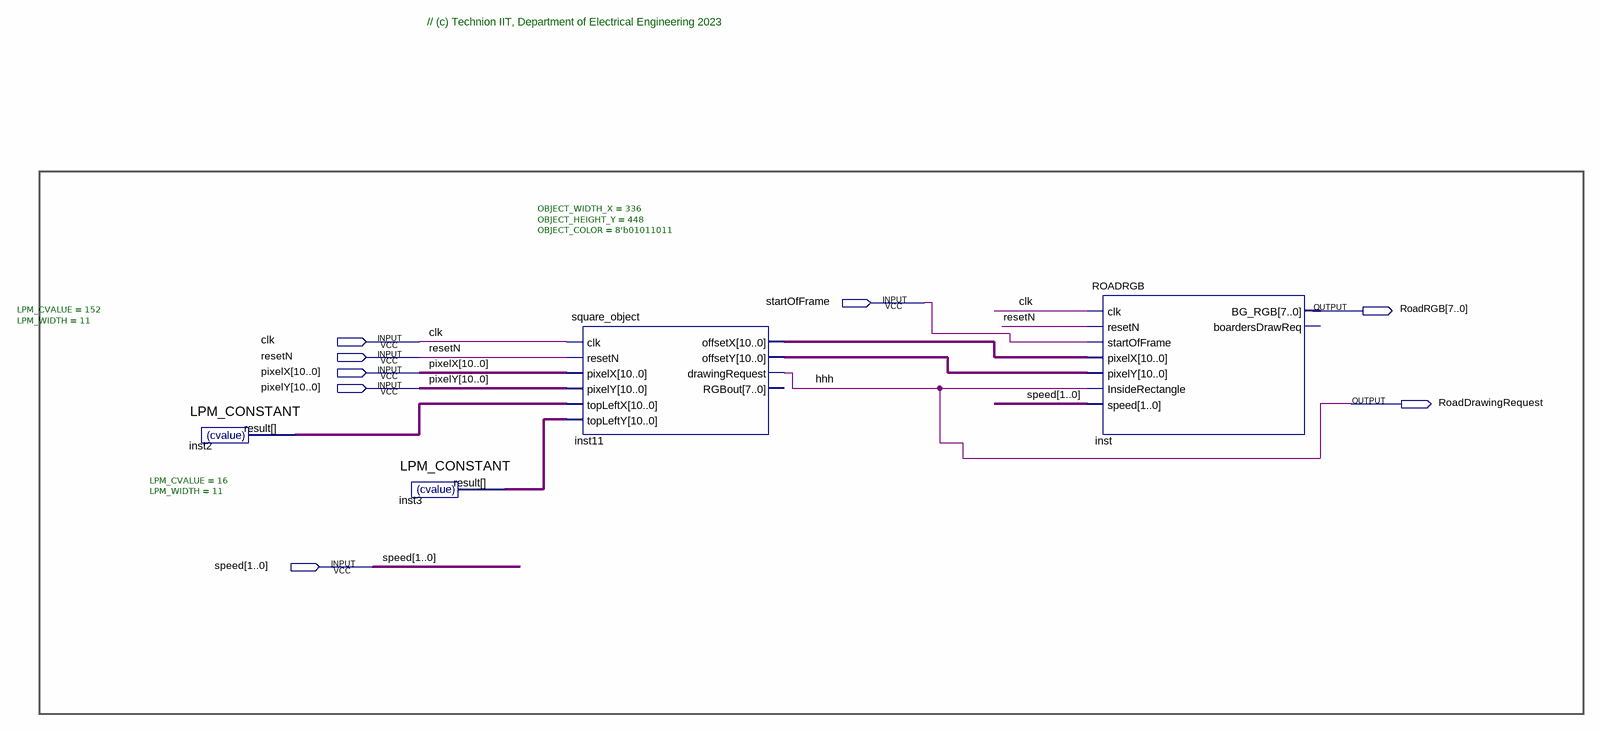
[diagram p0: schematic sheet]
// Quartus schematic ROAD_DISPLAY.bdf as structural Verilog: 4 symbols, 8 pins
module ROAD_DISPLAY (
  input  startOfFrame,
  input  clk,
  input  resetN,
  input  [10:0] pixelX,
  input  [10:0] pixelY,
  input  [1:0] speed,
  output [7:0] RoadRGB,
  output RoadDrawingRequest
);

  wire [10:0] inst2_result, inst3_result, inst11_offsetx, inst11_offsety;

  LPM_CONSTANT #(.LPM_CVALUE(152), .LPM_WIDTH(11)) inst2 (.result(inst2_result));
  LPM_CONSTANT #(.LPM_CVALUE(16), .LPM_WIDTH(11)) inst3 (.result(inst3_result));
  square_object #(.OBJECT_WIDTH_X(336), .OBJECT_HEIGHT_Y(448), .OBJECT_COLOR(8'b01011011)) inst11 (
    .clk(clk), .resetN(resetN), .pixelX(pixelX), .pixelY(pixelY), .topLeftX(inst2_result),
    .topLeftY(inst3_result), .offsetX(inst11_offsetx), .offsetY(inst11_offsety),
    .drawingRequest(RoadDrawingRequest));  // open: RGBout
  ROADRGB inst (
    .clk(clk), .resetN(resetN), .startOfFrame(startOfFrame), .pixelX(inst11_offsetx),
    .pixelY(inst11_offsety), .InsideRectangle(RoadDrawingRequest), .speed(speed), .BG_RGB(RoadRGB));  // open: boardersDrawReq

  // Other names for the same wires on the sheet: hhh = RoadDrawingRequest

  // Notes on the sheet:
  //   // (c) Technion IIT, Department of Electrical Engineering 2023
endmodule
